# EAGLE design Si4844-A10 Radio LM386 6-25 8.11 (EAGLE 8.2.1)
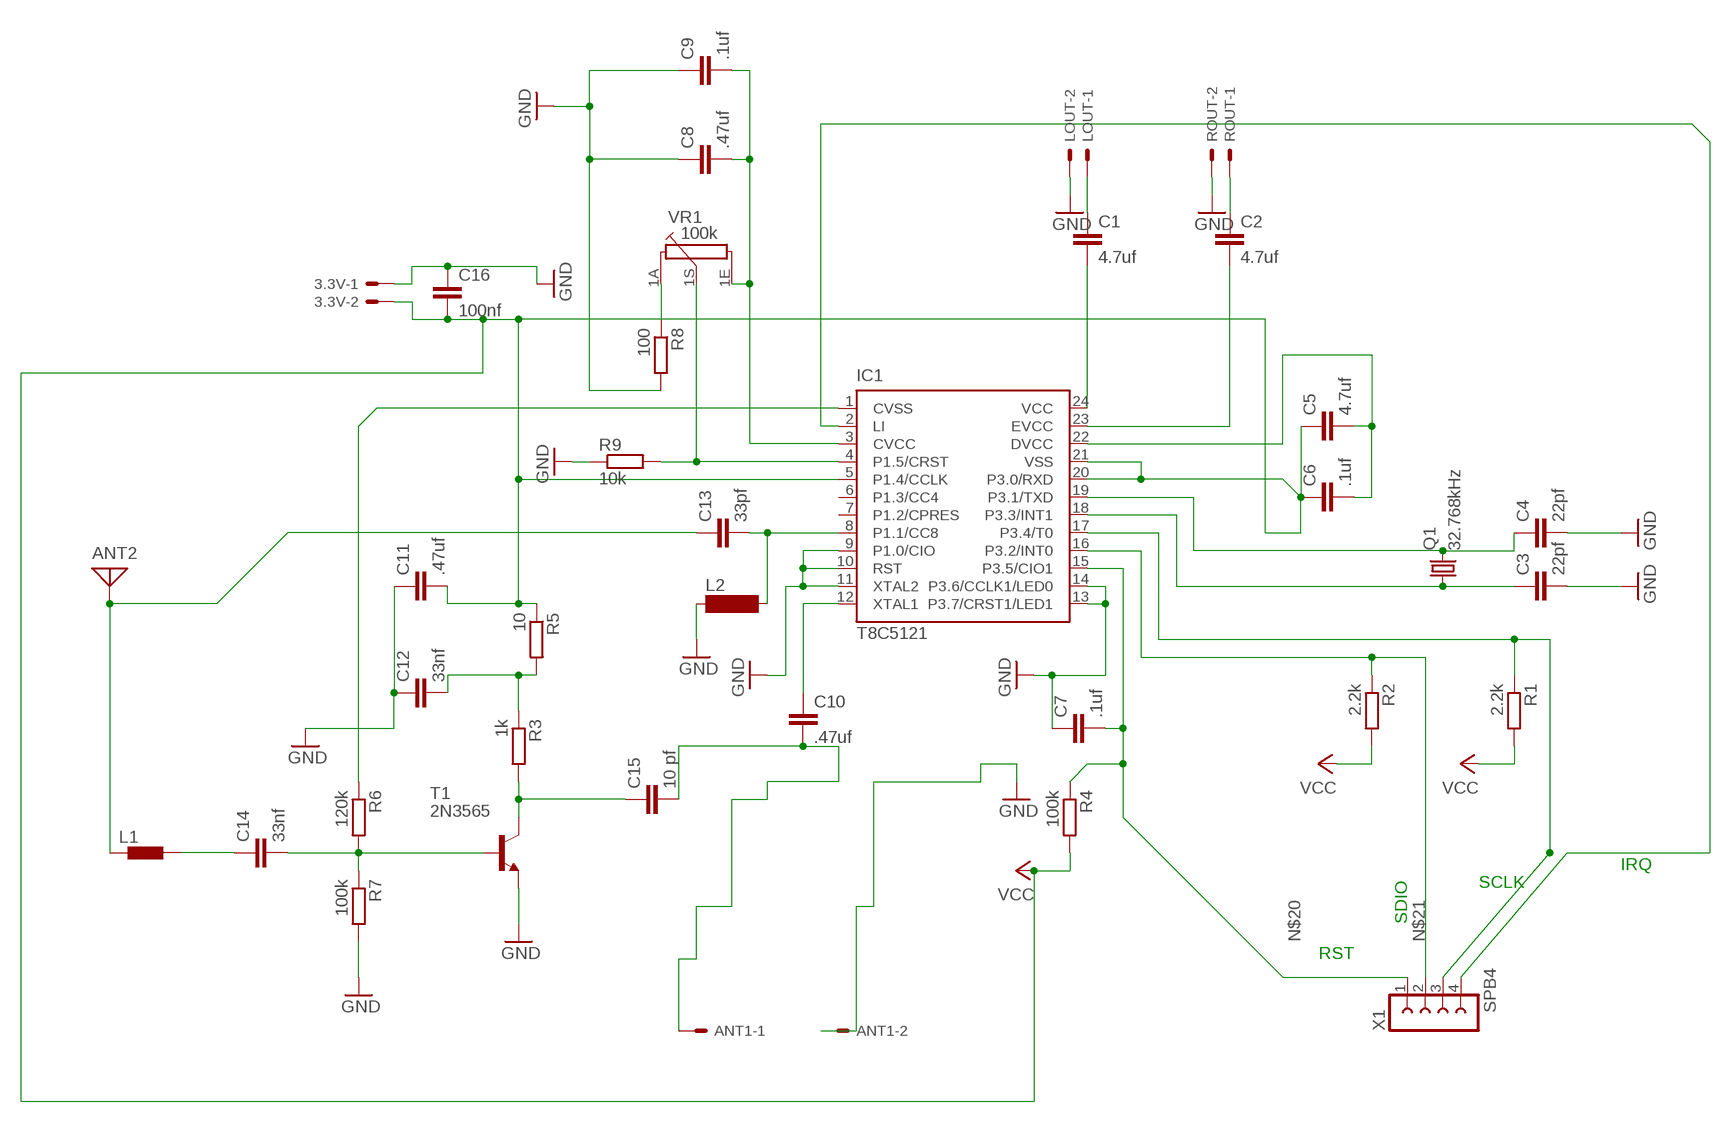
[diagram p0: schematic, sheet 1]

## Parts
3.3V  22-23-2021  [22-23-2021]
ANT1  332-02  [332-02]
ANT2  ANTENNA  [PAD-01]
C1  4.7uf  C2.5/2  [C2.5-2]
C2  4.7uf  C2.5/2  [C2.5-2]
C3  22pf  C2.5/2  [C2.5-2]
C4  22pf  C2.5/2  [C2.5-2]
C5  4.7uf  C2.5/2  [C2.5-2]
C6  .1uf  C2.5/2  [C2.5-2]
C7  .1uf  C2.5/2  [C2.5-2]
C8  .47uf  C2.5/2  [C2.5-2]
C9  .1uf  C2.5/2  [C2.5-2]
C10  .47uf  C2.5/2  [C2.5-2]
C11  .47uf  C2,5-3  [C2.5-3]
C12  33nf  C2,5-3  [C2.5-3]
C13  33pf  C2,5-3  [C2.5-3]
C14  33nf  C2,5-3  [C2.5-3]
C15  10 pf  C2,5-3  [C2.5-3]
C16  100nf  C2.5/2  [C2.5-2]
IC1  T8C5121  [SSOP24]
L1  BLM15HB121SN1  [0402]
L2  SM-1206  [SM-1206]
LOUT  22-23-2021  [22-23-2021]
Q1  32.768kHz  CRYSTALTC26V  [TC26V]
R1  2.2k  R-EU_0204/7  [0204/7]
R2  2.2k  R-EU_0204/7  [0204/7]
R3  1k  R-EU_0204/7  [0204/7]
R4  100k  R-EU_0204/7  [0204/7]
R5  10  R-EU_0204/7  [0204/7]
R6  120k  R-EU_0204/7  [0204/7]
R7  100k  R-EU_0204/7  [0204/7]
R8  100  R-EU_0204/7  [0204/7]
R9  10k  R-EU_0204/7  [0204/7]
ROUT  22-23-2021  [22-23-2021]
T1  2N3565  [TO92]
VR1  100k  PC16S  [PC16S]
X1  SPB4  [SPB4]

## Nets
GND: 3.3V.1 ANT1.2 C3.2 C4.2 C7.1 C8.1 C9.1 C11.1 C12.1 C16.1 IC1.9(P1.0/CIO) IC1.10(RST) IC1.11(XTAL2) IC1.13(P3.7/CRST1/LED1) IC1.14(P3.6/CCLK1/LED0) L2.1 LOUT.2 R7.2 R8.2 R9.1 ROUT.2 T1.3(E)
N$1: C10.1 IC1.12(XTAL1)
N$2: C13.2 IC1.8(P1.1/CC8) L2.2
N$3: C15.1 R3.2 T1.1(C)
N$4: C12.2 R3.1 R5.2
N$5: IC1.17(P3.4/T0) R1.1 X1.3
N$6: C14.2 R6.2 R7.1 T1.2(B)
N$7: C14.1 L1.2
N$8: ANT2.1 C13.1 L1.1
N$9: IC1.4(P1.5/CRST) R9.2 VR1.1S
N$10: IC1.1(CVSS) R6.1
N$11: C1.2 IC1.24(VCC)
N$12: C8.2 C9.2 IC1.3(CVCC) VR1.1E
N$13: C2.2 IC1.23(EVCC)
N$14: C1.1 LOUT.1
N$15: R8.1 VR1.1A
N$16: C2.1 ROUT.1
N$17: C5.2 C6.2 IC1.22(DVCC)
N$18: C4.1 IC1.19(P3.1/TXD) Q1.2
N$19: C3.1 IC1.18(P3.3/INT1) Q1.1
N$20: C7.2 IC1.15(P3.5/CIO1) R4.1 X1.1
N$21: IC1.16(P3.2/INT0) R2.1 X1.2
N$22: IC1.2(LI) X1.4
N$23: ANT1.1 C10.2 C15.2
VCC: 3.3V.2 C5.1 C6.1 C11.2 C16.2 IC1.5(P1.4/CCLK) IC1.20(P3.0/RXD) IC1.21(VSS) R1.2 R2.2 R4.2 R5.1
Unconnected: IC1.6(P1.3/CC4) IC1.7(P1.2/CPRES)

## Notes on the sheet
- IRQ
- SCLK
- SDIO
- RST

## Library data of the parts
3.3V LOUT ROUT = con-molex:22-23-2021: .100" (2.54mm) Center Header - 2 Pin; MF: MOLEX; MPN: 22-23-2021; OC_FARNELL: 1462926; OC_NEWARK: 25C3832
ANT1 = con-garry:332-02: 2 Pin - 2mm Dual Row Source: www.mpe-connector.de / garry_shortform_2012.pdf
ANT2 = discrete:ANTENNA: Antenna
C1-C16 = capacitor-wima:C: CAPACITOR naming: grid - package width
IC1 = atmel:T8*C5121: 8-bit Microcontroller with Multiprotocol Smart Card Interface Source: Uploaded by Heiko Künzel <heiko.kuenzel@atg-gera.de> from ATG Automatisierungstechnik Gera Mon Mar 10 13:32:48 2003 Atmel-Library mit zusätzlich T83C5121-Prozessor im SSOP24-Package.; OC_FARNELL: unknown; OC_NEWARK: unknown
L1 = inductors:BLM15H: EMIFIL (R) Chip Ferrite Bead for GHz Noise Source: http://www.murata.com/ Ferrite Bead BLM15H.pdf
L2 = inductor-neosid:SM-1206: INDUCTOR SMD chip inductor; OC_FARNELL: unknown; OC_NEWARK: unknown
Q1 = crystal:CRYSTAL: CRYSTAL; OC_FARNELL: unknown; OC_NEWARK: unknown
R1-R9 = rcl:R-EU_: RESISTOR, European symbol
T1 = transistor:2N3565: NPN TRANSISTOR
VR1 = piher:PC16S: POTENTIOMETER single carbon potentiometer, 16 mm, S3ROH; OC_FARNELL: 4452940; OC_NEWARK: unknown
X1 = con-hirschmann:SPB4: CONNECTOR 4 pins; OC_FARNELL: unknown; OC_NEWARK: unknown

## Net classes
0 default: clearance 0.205 mm

## Board
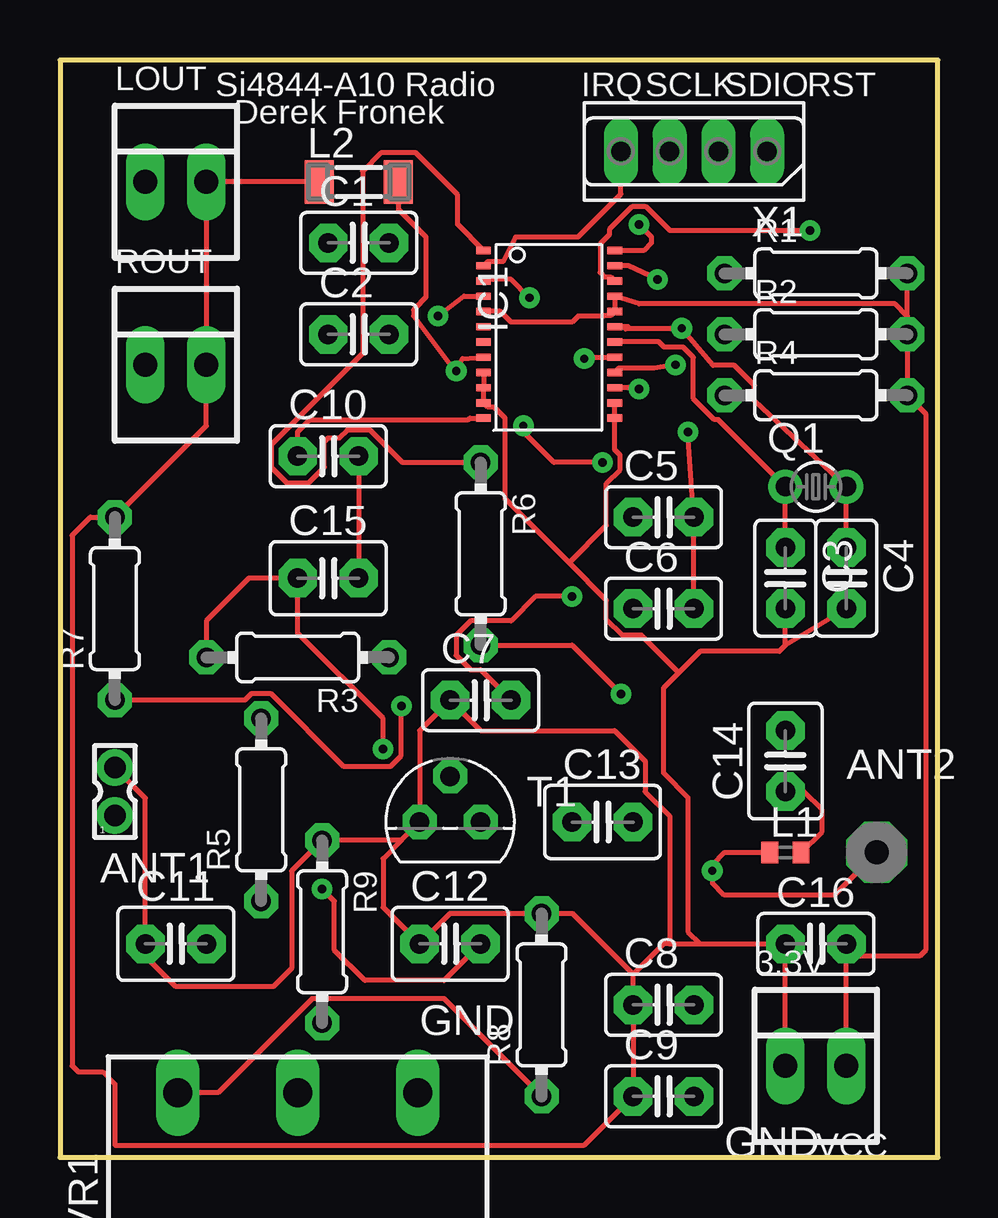
[diagram p1: board, top side]
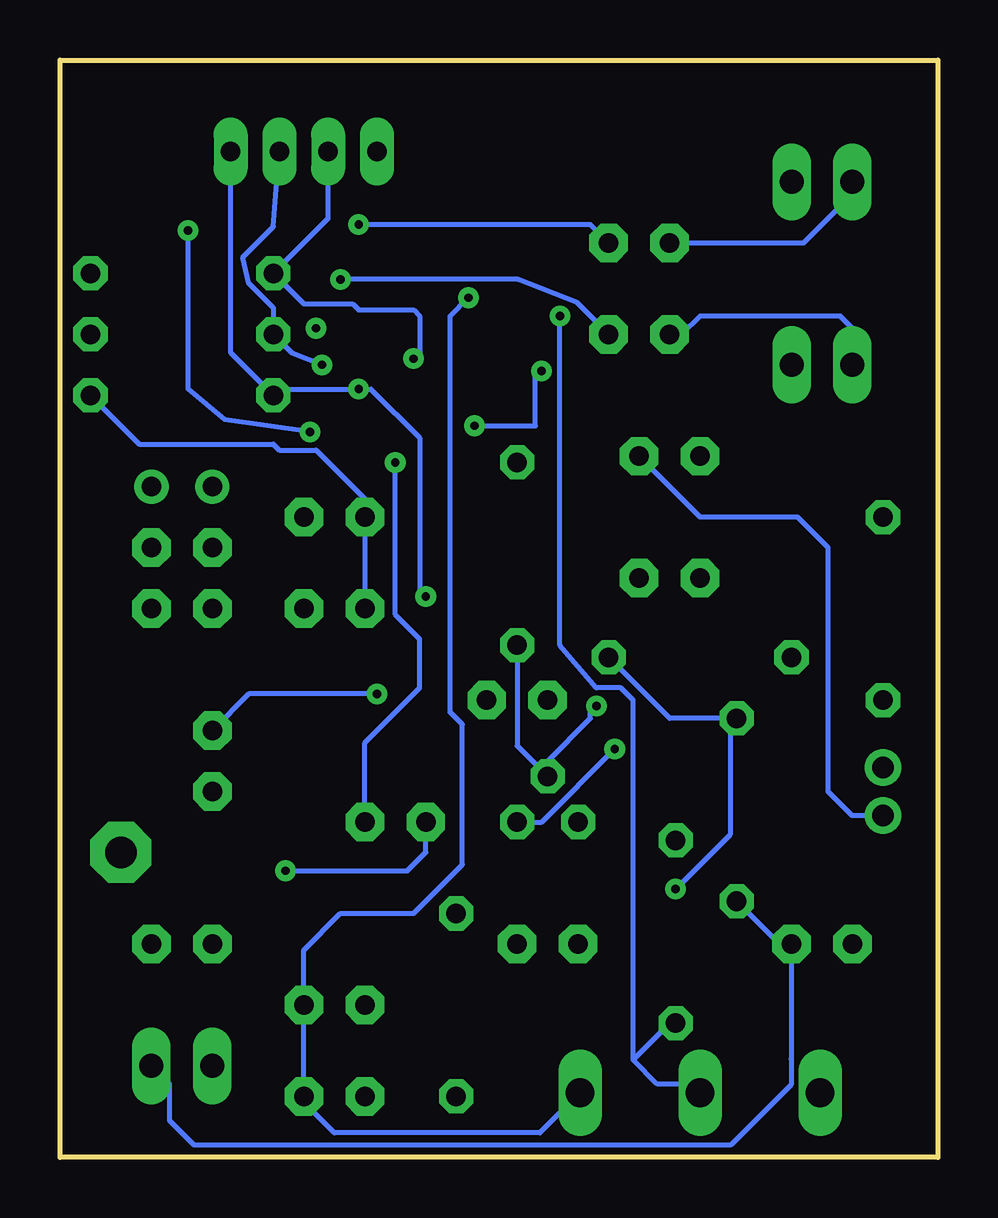
[diagram p2: board, bottom side, seen from below]

Size 36.58 x 45.72 mm. Coordinates in mm from the lower left corner, seen from the top.
Outline: 0,0 36.58,0 36.58,45.72 0,45.72 0,0
Copper layers (1*16): Top 0.035mm / dielectric 1.5mm / Bottom 0.035mm
Design rules "SparkFun": minimum track width 8mil, minimum drill 20mil, track to track 8mil, track to pad 8mil, pad to pad 8mil, via to via 8mil, smd to smd 8mil, copper to edge 8mil, drill to drill 8mil, minimum pad ring 12mil, minimum via ring 10mil, stop-mask expansion 4mil, vias tented up to drill 20mil, thermal gap 10mil

### Footprints (pad centres in the part's own frame; a part is rotated, then mirrored left to right if it is on the bottom)
22-23-2021 = drill 1 long: 1 -1.27,0; 2 1.27,0
332-02 = drill 0.9 pad 1.27: 1 0,-1; 2 0,1
PAD-01 = drill 1.321 pad 2.54 octagon: 1 0,0
C2.5-2 = drill 0.813 pad 1.6 octagon: 1 -1.27,0; 2 1.27,0
C2.5-3 = drill 0.813 pad 1.6 octagon: 1 -1.27,0; 2 1.27,0
SSOP24 = smd 0.305 x 0.61: 1 -3.493,-1.651; 2 -2.857,-1.651; 3 -2.223,-1.651; 4 -1.587,-1.651; 5 -0.953,-1.651; 6 -0.318,-1.651; 7 0.318,-1.651; 8 0.953,-1.651; 9 1.587,-1.651; 10 2.223,-1.651; 11 2.857,-1.651; 12 3.493,-1.651; 13 3.493,3.81; 14 2.857,3.81; 15 2.223,3.81; 16 1.587,3.81; 17 0.953,3.81; 18 0.318,3.81; 19 -0.318,3.81; 20 -0.953,3.81; 21 -1.587,3.81; 22 -2.223,3.81; 23 -2.857,3.81; 24 -3.493,3.81
0402 = smd 0.7 x 0.9: 1 -0.65,0; 2 0.65,0
SM-1206 = smd 1.2 x 1.8: 1 -1.65,0; 2 1.65,0
TC26V = drill 0.813: 1 -1.27,0; 2 1.27,0
0204/7 = drill 0.813 octagon: 1 -3.81,0; 2 3.81,0
TO92 = drill 0.813 octagon: 1 1.27,0; 2 0,1.905; 3 -1.27,0
PC16S = drill 1.2 long: 1A -5,6.5; 1E 5,6.5; 1S 0,6.5
SPB4 = drill 0.813 long: 1 -3.048,0; 2 -1.016,0; 3 1.016,0; 4 3.048,0

### Placement (x,y rotation side)
3.3V  31.5,3.81 0 top
ANT1  2.29,15.24 0 top
ANT2  34.04,12.7 0 top
C1  12.45,38.1 0 top
C2  12.45,34.29 0 top
C3  30.23,24.13 270 top
C4  32.77,24.13 270 top
C5  25.15,26.67 0 top
C6  25.15,22.86 0 top
C7  17.53,19.05 0 top
C8  25.15,6.35 0 top
C9  25.15,2.54 0 top
C10  11.18,29.21 0 top
C11  4.83,8.89 0 top
C12  16.26,8.89 0 top
C13  22.61,13.97 0 top
C14  30.23,16.51 90 top
C15  11.18,24.13 0 top
C16  31.5,8.89 0 top
IC1  19.3,34.29 270 top
L1  30.23,12.7 0 top
L2  12.45,40.64 0 top
LOUT  4.83,40.64 0 top
Q1  31.5,27.94 0 top
R1  31.5,36.83 0 top
R2  31.5,34.29 0 top
R3  9.91,20.83 180 top
R4  31.5,31.75 0 top
R5  8.38,14.48 90 top
R6  17.53,25.15 270 top
R7  2.29,22.86 90 top
R8  20.07,6.35 90 top
R9  10.92,9.4 270 top
ROUT  4.83,33.02 0 top
T1  16.26,13.97 0 top
VR1  9.91,-3.81 0 top
X1  26.42,41.91 180 top

### Tracks (layer width: path | path; a pad name or v marks a point on that pad's centre or on a via)
GND
  Top 0.203: 3.3V.1 C16.1 26.67,8.89 | 25.4,8.89 26.67,8.89 | 25.4,8.89 25.15,8.89 23.88,7.62 | 23.88,7.62 C8.1 C9.1 21.84,0.51 2.29,0.51 2.29,3.05 1.78,3.56 0.76,3.56 0.51,3.81 0.51,25.91 1.27,26.67 R7.2 6.1,30.48 ROUT.2 LOUT.2 L2.1 | 26.67,8.89 26.16,9.4 26.16,14.99 25.15,16 25.15,19.56 25.78,20.19 | 30.23,21.34 C3.2 | 30.23,21.34 29.97,21.08 26.67,21.08 25.78,20.19 | C4.2 30.23,21.34 | 14.22,13.21 T1.3 14.99,17.78 C7.1 17.53,17.78 23.11,17.78 24.38,16.51 24.38,15.24 25.4,14.22 25.4,8.89 | 14.22,13.21 R9.1 9.65,11.94 9.65,7.87 8.89,7.11 4.83,7.11 3.56,8.38 C11.1 3.56,14.97 ANT1.2 | 14.22,13.21 13.46,12.45 13.46,10.41 C12.1 16.26,10.16 R8.2 21.34,10.16 23.88,7.62 | IC1.14 IC1.13 23.11,29.49 23.34,29.26 23.34,28.65 22.77,28.08 22.77,26.33 21.21,24.77 | IC1.9 IC1.10 IC1.11 17.83,31.26 18.08,31.26 18.54,30.8 18.54,27.43 21.21,24.77 | 21.21,24.77 22.77,23.2 22.77,22.4 23.42,21.75 24.22,21.75 25.78,20.19
N$1
  Top 0.203: C10.1 9.91,30.23 10.41,30.73 17.02,30.73 17.08,30.8 IC1.12
N$2  (via drill 0.35)
  Top 0.203: L2.2 14.1,39.5 15.24,38.35 15.24,35.84 15.01,35.61 15.01,35.59 14.73,35.31 14.73,35.05 16.26,33.02 v16.51,32.77 16.76,33.27 IC1.8 | v22.61,28.96 20.57,28.96 19.3,30.23 v19.3,30.48
  Bottom 0.203: C13.2 23.88,17.27 21.59,19.56 21.59,21.59 22.61,22.61 v22.61,28.96 | v19.3,30.48 16.76,30.48 16.76,32.51 v16.51,32.77
N$3  (via drill 0.35)
  Top 0.203: R3.2 6.1,22.35 7.87,24.13 C15.1 9.91,21.84 13.46,18.29 v13.46,17.02
  Bottom 0.203: T1.1 16.51,13.97 v13.46,17.02
N$4  (via drill 0.35)
  Top 0.203: C12.2 16,7.37 12.7,7.37 11.43,8.64 11.43,10.67 v10.92,11.18
  Bottom 0.203: 8.64,18.29 R5.2 | 8.64,18.29 11.18,18.29 R3.1 | v10.92,11.18 8.64,13.46 8.64,18.29
N$5  (via drill 0.35)
  Top 0.203: v21.84,33.27 21.91,33.34 IC1.17
  Bottom 0.203: X1.3 25.4,39.12 R1.1 26.42,35.56 24.38,35.56 24.13,35.31 21.84,35.31 21.59,35.05 21.59,33.53 v21.84,33.27
N$6  (via drill 0.35)
  Top 0.203: R6.2 21.34,21.34 v23.37,19.3 | v14.22,18.8 14.2,18.77 14.2,16.71 13.77,16.28 11.83,16.28 8.8,19.31 7.96,19.31 7.7,19.05 R7.1
  Bottom 0.203: v23.37,19.3 28.7,19.3 C14.2 | R6.2 17.53,17.15 T1.2 16.26,16.51 14.48,18.29 14.48,18.54 v14.22,18.8
N$7
  Top 0.203: L1.2 31.75,13.57 31.75,14.48 30.99,15.24 C14.1
N$8  (via drill 0.35)
  Top 0.203: ANT2.1 32.26,10.92 27.69,10.92 27.18,11.43 v27.18,11.94 27.18,12.19 27.69,12.7 L1.1
  Bottom 0.203: v27.18,11.94 22.1,11.94 21.34,12.7 C13.1
N$9  (via drill 0.35)
  Top 0.203: IC1.4 16.83,35.88 v15.75,35.05
  Bottom 0.203: VR1.1S 10.26,3.05 11.68,3.05 12.7,4.06 | v15.75,35.05 15.75,21.34 14.22,19.56 13.21,19.56 12.7,19.05 12.7,4.06 | 12.7,4.06 11.18,5.59 R9.2
N$10
  Top 0.203: IC1.1 16.56,38.87 16.56,40.11 14.82,41.85 13.37,41.85 12.61,41.09 12.61,33.51 8.8,29.7 8.8,28.75 9.45,28.1 10.36,28.1 11.01,28.75 11.01,29.81 11.18,29.97 11.64,29.97 11.99,30.32 12.9,30.32 14.27,28.96 R6.1
N$11  (via drill 0.35)
  Top 0.203: v24.13,38.86 24.64,38.35 24.64,38.1 24.32,37.78 IC1.24
  Bottom 0.203: C1.2 14.48,38.86 v24.13,38.86
N$12  (via drill 0.35)
  Top 0.203: v19.56,35.81 18.8,36.58 18.03,36.58 | 18.03,36.58 17.59,36.58 | 18.03,36.58 17.72,36.58 IC1.3
  Bottom 0.203: VR1.1E 16.58,1.02 25.15,1.02 26.42,2.29 C9.2 C8.2 26.42,8.64 24.89,10.16 21.84,10.16 19.81,12.19 19.81,18.03 20.32,18.54 20.32,35.05 v19.56,35.81
N$13  (via drill 0.35)
  Top 0.203: v24.89,36.58 23.69,37.15 IC1.23
  Bottom 0.203: C2.2 15.01,35.59 15.01,35.61 17.5,36.58 v24.89,36.58
N$14
  Bottom 0.203: C1.1 5.59,38.1 3.56,40.13 LOUT.1
N$15
  Top 0.203: VR1.1A 6.58,2.69 10.5,6.61 16,6.61 R8.1
N$16
  Bottom 0.203: ROUT.1 3.56,34.54 4.06,35.05 9.91,35.05 10.67,34.29 C2.1
N$17  (via drill 0.35)
  Top 0.203: C6.2 C5.2 v26.16,30.23 | v31.24,38.61 25.42,38.61 24.44,39.6 23.83,39.6 22.89,38.66 22.89,38.45 22.5,38.06 22.5,36.87 22.68,36.69 22.94,36.69 IC1.22
  Bottom 0.203: v26.16,30.23 29.72,30.73 31.24,32 v31.24,38.61
N$18  (via drill 0.35)
  Top 0.203: C4.1 Q1.2 28.93,31.52 28.93,32.16 28.1,33 27.22,33 v25.91,34.54 25.68,34.52 23.57,34.52 23.66,34.61 IC1.19
N$19
  Top 0.203: C3.1 Q1.1 27.43,30.73 27.26,30.73 26.39,31.61 26.39,33.33 25.96,33.76 25.17,33.76 24.96,33.97 IC1.18
N$20  (via drill 0.35)
  Top 0.203: 24.19,32.07 v24.13,32 24.07,32.07 IC1.15 | v21.34,23.37 19.81,23.37 18.8,22.35 17.1,22.35 16.51,21.76 16.51,20.91 17.1,20.32 17.53,20.32 C7.2
  Bottom 0.203: X1.1 29.46,33.53 R4.1 27.43,32 v24.13,32 23.62,32 21.59,29.97 21.59,23.62 v21.34,23.37
N$21  (via drill 0.35)
  Top 0.203: IC1.16 23.29,32.88 24.75,32.88 v25.65,33.02
  Bottom 0.203: X1.2 27.69,38.78 28.96,37.51 28.7,36.41 27.69,35.39 R2.1 26.92,33.53 v25.65,33.02
N$22
  Top 0.203: X1.4 23.37,40.13 21.59,38.35 18.99,38.35 18.47,37.32 18.21,37.32 17.83,37.32 IC1.2
N$23
  Top 0.203: C10.2 C15.2
  Bottom 0.203: ANT1.1 3.57,14.24 4.57,15.24 4.57,25.4 5.84,26.67 9.91,26.67 C10.2
VCC
  Top 0.203: 35.31,35.05 R2.2 R4.2 36.07,30.99 36.07,8.64 35.81,8.38 33.27,8.38 arc-90 C16.2 3.3V.2 | 35.31,35.05 R1.2 | 35.31,35.05 34.8,35.56 24.13,35.56 IC1.21 IC1.20 22.94,35.07 22.68,35.07 22.67,35.05 21.59,35.05 21.34,34.8 18.8,34.8 18.35,35.24 IC1.5
  Bottom 0.203: R4.2 33.27,29.72 27.69,29.72 27.43,29.46 25.91,29.46 23.88,27.43 C5.1 C6.1 | 3.3V.2 32,3.05 32,1.52 30.99,0.51 8.64,0.51 6.12,3.03 6.12,4.1 6.1,4.12 C11.2 6.6,8.89 R5.1

### Text on the board
tPlace: Si4844-A10 Radio | SCLK | SDIO | RST | Derek Fronek | IRQ | GND | GND | VCC